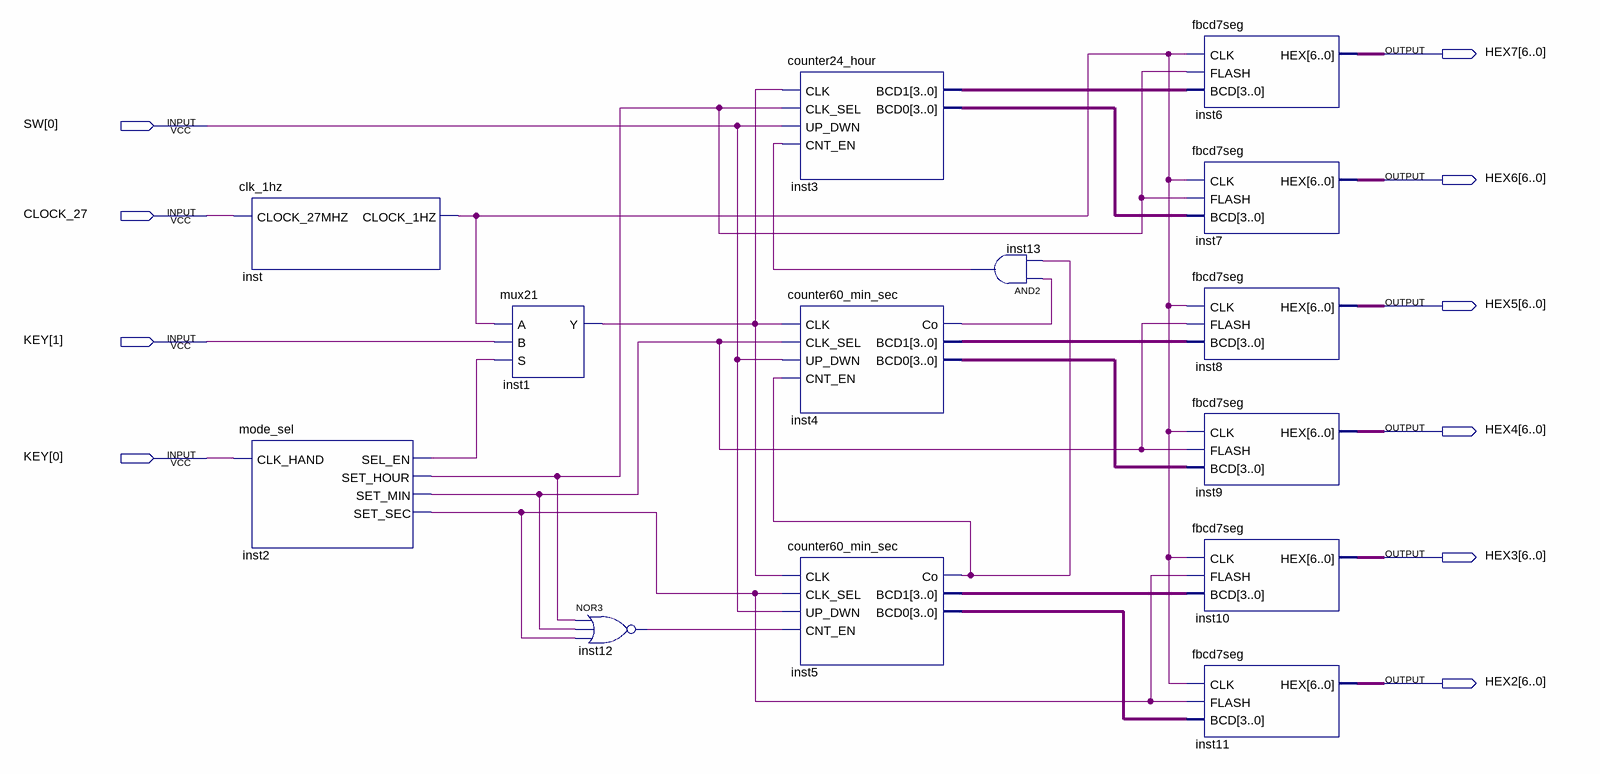
[diagram p0: schematic sheet]
// Quartus schematic electricTimerBsf.bdf as structural Verilog: 14 symbols, 10 pins
module electricTimerBsf (
  input  [0:0] SW,
  input  CLOCK_27,
  input  [1:0] KEY,
  output [6:0] HEX7,
  output [6:0] HEX6,
  output [6:0] HEX5,
  output [6:0] HEX4,
  output [6:0] HEX3,
  output [6:0] HEX2
);

  wire inst1_y, inst2_sel_en, inst2_set_hour, inst2_set_min, inst2_set_sec, inst4_co, inst5_co, inst12_out,
       inst13_out, inst_clock_1hz;
  wire [3:0] inst3_bcd0, inst3_bcd1, inst4_bcd0, inst4_bcd1, inst5_bcd0, inst5_bcd1;

  clk_1hz inst (.CLOCK_27MHZ(CLOCK_27), .CLOCK_1HZ(inst_clock_1hz));
  mode_sel inst2 (
    .CLK_HAND(KEY[0]), .SEL_EN(inst2_sel_en), .SET_HOUR(inst2_set_hour), .SET_MIN(inst2_set_min),
    .SET_SEC(inst2_set_sec));
  mux21 inst1 (.A(inst_clock_1hz), .B(KEY[1]), .S(inst2_sel_en), .Y(inst1_y));
  nor inst12 (inst12_out, inst2_set_hour, inst2_set_min, inst2_set_sec);
  counter24_hour inst3 (
    .CLK(inst1_y), .CLK_SEL(inst2_set_hour), .UP_DWN(SW[0]), .CNT_EN(inst13_out), .BCD1(inst3_bcd1),
    .BCD0(inst3_bcd0));
  counter60_min_sec inst4 (
    .CLK(inst1_y), .CLK_SEL(inst2_set_min), .UP_DWN(SW[0]), .CNT_EN(inst5_co), .Co(inst4_co),
    .BCD1(inst4_bcd1), .BCD0(inst4_bcd0));
  counter60_min_sec inst5 (
    .CLK(inst1_y), .CLK_SEL(inst2_set_sec), .UP_DWN(SW[0]), .CNT_EN(inst12_out), .Co(inst5_co),
    .BCD1(inst5_bcd1), .BCD0(inst5_bcd0));
  and inst13 (inst13_out, inst4_co, inst5_co);
  fbcd7seg inst6 (.CLK(inst_clock_1hz), .FLASH(inst2_set_hour), .BCD(inst3_bcd1), .HEX(HEX7));
  fbcd7seg inst7 (.CLK(inst_clock_1hz), .FLASH(inst2_set_hour), .BCD(inst3_bcd0), .HEX(HEX6));
  fbcd7seg inst8 (.CLK(inst_clock_1hz), .FLASH(inst2_set_min), .BCD(inst4_bcd1), .HEX(HEX5));
  fbcd7seg inst9 (.CLK(inst_clock_1hz), .FLASH(inst2_set_min), .BCD(inst4_bcd0), .HEX(HEX4));
  fbcd7seg inst10 (.CLK(inst_clock_1hz), .FLASH(inst2_set_sec), .BCD(inst5_bcd1), .HEX(HEX3));
  fbcd7seg inst11 (.CLK(inst_clock_1hz), .FLASH(inst2_set_sec), .BCD(inst5_bcd0), .HEX(HEX2));
endmodule
